# EAGLE schematic tyraka3.0 (EAGLE 9.6.2)
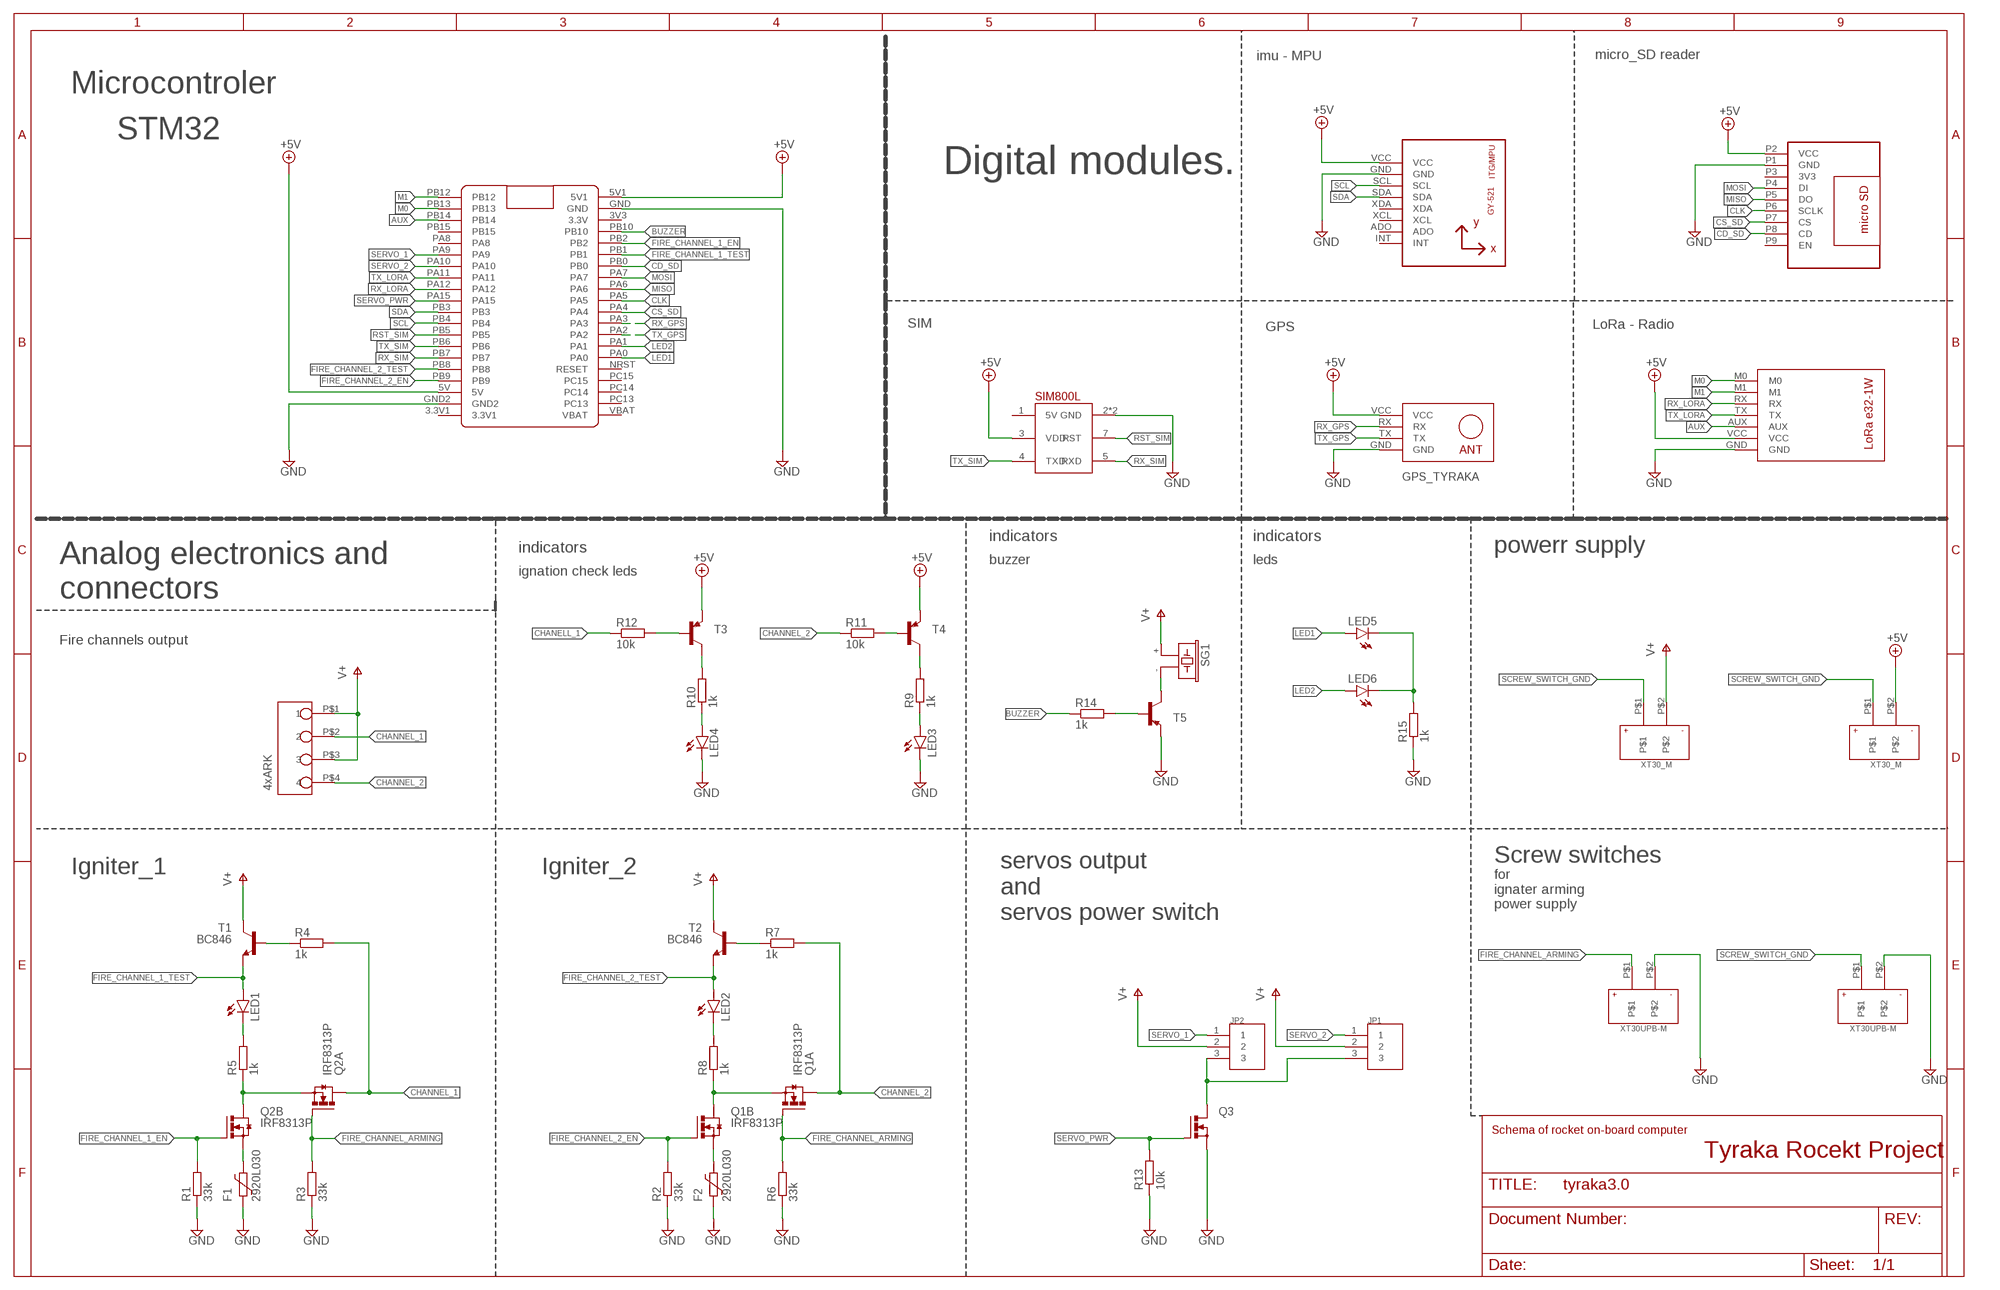
[diagram p0: schematic, sheet 1]

## Parts
F1  2920L030  [2920L]
F2  2920L030  [2920L]
JP1  3PIN  [B3B-PH-K-S]
JP2  3PIN  [B3B-PH-K-S]
LED1  LEDCHIP-LED0805  [CHIP-LED0805]
LED2  LEDCHIP-LED0805  [CHIP-LED0805]
LED3  LEDCHIP-LED0805  [CHIP-LED0805]
LED4  LEDCHIP-LED0805  [CHIP-LED0805]
LED5  LEDCHIP-LED0805  [CHIP-LED0805]
LED6  LEDCHIP-LED0805  [CHIP-LED0805]
Q1  IRF8313P  [SO-08]
Q2  IRF8313P  [SO-08]
Q3  N-MOSFET-SO8S  [SO-08]
R1  33k  R-EU_R0805  [R0805]
R2  33k  R-EU_R0805  [R0805]
R3  33k  R-EU_R0805  [R0805]
R4  1k  R-EU_R0805  [R0805]
R5  1k  R-EU_R0805  [R0805]
R6  33k  R-EU_R0805  [R0805]
R7  1k  R-EU_R0805  [R0805]
R8  1k  R-EU_R0805  [R0805]
R9  1k  R-EU_R0805  [R0805]
R10  1k  R-EU_R0805  [R0805]
R11  10k  R-EU_R0805  [R0805]
R12  10k  R-EU_R0805  [R0805]
R13  10k  R-EU_R0805  [R0805]
R14  1k  R-EU_R0805  [R0805]
R15  1k  R-EU_R0805  [R0805]
SD1  MICRO_SD  [MICRO_SD]
SG1  F/CM12P  [F/CM12P]
T1  BC846  [SOT23]
T2  BC846  [SOT23]
T3  BC856A-PNP-SOT23-BEC  [SOT23-BEC]
T4  BC856A-PNP-SOT23-BEC  [SOT23-BEC]
T5  BC856A-PNP-SOT23-BEC  [SOT23-BEC]
U2  GY-521MPU6050  [GY-521]
U$1  SIM800L  [SIP]
U$2  LORA_E32  [LORA_E32]
U$3  BLUE_PILL  [BLUE_PILL]
U$4  GPS_TYRAKA  [GPS-RECEIVER-NEO6M]
U$5  XT30_MALE_90  [XT60_MALE_90]
U$6  XT30_MALE_90  [XT60_MALE_90]
U$7  4X_ARK_8.5MM  [4XZLACZESRUBOWE]
U$8  XT30UPB-M  [XT30UPB-M]
U$9  XT30UPB-M  [XT30UPB-M]

## Nets
+5V: SD1.P2(VCC) T3.E T4.E U2.VCC U$1.3(VDD) U$2.VCC U$3.5V U$3.5V1 U$4.VCC U$6.P$2
AUX: U$2.AUX U$3.PB14
BUZZER: R14.1 U$3.PB10
CD_SD: SD1.P8(CD) U$3.PB0
CHANELL_1: R12.1
CHANNEL_1: Q2.5(A:D) Q2.6(A:D) R4.2 U$7.P$2
CHANNEL_2: Q1.5(A:D) Q1.6(A:D) R7.2 R11.1 U$7.P$4
CLK: SD1.P6(SCLK) U$3.PA5
CS_SD: SD1.P7(CS) U$3.PA4
FIRE_CHANNEL_1_EN: Q2.2(B:G) R1.2 U$3.PB2
FIRE_CHANNEL_1_TEST: LED1.A T1.2(E) U$3.PB1
FIRE_CHANNEL_2_EN: Q1.2(B:G) R2.2 U$3.PB9
FIRE_CHANNEL_2_TEST: LED2.A T2.2(E) U$3.PB8
FIRE_CHANNEL_ARMING: Q1.4(A:G) Q2.4(A:G) R3.2 R6.2 U$8.P$1
GND: F1.2 F2.2 LED3.C LED4.C Q3.1(S) Q3.2(S) Q3.3(S) R1.1 R2.1 R3.1 R6.1 R13.1 R15.1 SD1.P1(GND) T5.E U2.GND U$1.2(GND) U$1.6(GND) U$2.GND U$3.GND U$3.GND2 U$4.GND U$8.P$2 U$9.P$2
LED1: LED5.A U$3.PA0
LED2: LED6.A U$3.PA1
M0: U$2.M0 U$3.PB13
M1: U$2.M1 U$3.PB12
MISO: SD1.P5(DO) U$3.PA6
MOSI: SD1.P4(DI) U$3.PA7
N$1: F1.1 Q2.1(B:S)
N$2: F2.1 Q1.1(B:S)
N$3: Q2.3(A:S) Q2.7(B:D) Q2.8(B:D) R5.1
N$4: Q1.3(A:S) Q1.7(B:D) Q1.8(B:D) R8.1
N$5: LED1.C R5.2
N$6: SG1.- T5.C
N$7: LED2.C R8.2
N$8: R14.2 T5.B
N$9: R4.1 T1.1(B)
N$10: R7.1 T2.1(B)
N$11: R12.2 T3.B
N$12: R10.2 T3.C
N$13: LED4.A R10.1
N$14: LED5.C LED6.C R15.2
N$16: R9.2 T4.C
N$17: LED3.A R9.1
N$18: R11.2 T4.B
N$19: JP1.3 JP2.3 Q3.5(D) Q3.6(D) Q3.7(D) Q3.8(D)
RST_SIM: U$1.7(RST) U$3.PB5
RX_GPS: U$3.PA3 U$4.RX
RX_LORA: U$2.RX U$3.PA12
RX_SIM: U$1.5(RXD) U$3.PB7
SCL: U2.SCL U$3.PB4
SCREW_SWITCH_GND: U$5.P$1 U$6.P$1 U$9.P$1
SDA: U2.SDA U$3.PB3
SERVO_1: JP2.1 U$3.PA9
SERVO_2: JP1.1 U$3.PA10
SERVO_PWR: Q3.4(G) R13.2 U$3.PA15
TX_GPS: U$3.PA2 U$4.TX
TX_LORA: U$2.TX U$3.PA11
TX_SIM: U$1.4(TXD) U$3.PB6
V+: JP1.2 JP2.2 SG1.+ T1.3(C) T2.3(C) U$5.P$2 U$7.P$1 U$7.P$3
Unconnected: SD1.P3(3V3) SD1.P9(EN) U2.ADO U2.INT U2.XCL U2.XDA U$1.1(5V) U$3.3.3V1 U$3.3V3(3.3V) U$3.NRST(RESET) U$3.PA8 U$3.PB15 U$3.PC13 U$3.PC14 U$3.PC15 U$3.VBAT

## Notes on the sheet
- imu - MPU | micro_SD reader
- Microcontroler
- STM32
- Digital modules.
- SIM | GPS | LoRa - Radio
- indicators | indicators
- indicators | powerr supply
- buzzer | leds
- ignation check leds
- Analog electronics and
  connectors
- Fire channels output
- Screw switches
- Igniter_1 | Igniter_2
- for
  ignater arming
  power supply
- servos output
  and
  servos power switch
- Schema of rocket on-board computer
- Tyraka Rocekt Project

## Library data of the parts
F1 F2 = polyfuse-smd_10 (1):?: Polyfuse Resettable PTC Source: http://www.littelfuse.com/products/resettable-ptcs.aspx; MF: Littelfuse; MPN: 2920L030; OC_FARNELL: 1822222; OC_NEWARK: 18M4789
JP1 JP2 = jst_eph:3PIN
LED1-LED6 = led:LED: LED OSRAM: - CHIPLED LG R971, LG N971, LY N971, LG Q971, LY Q971, LO R971, LY R971 LH N974, LH R974 LS Q976, LO Q976, LY Q976 LO Q996 - Hyper CHIPLED LW Q18S LB Q993, LB Q99A, LB R99A - SideLED LS A670, LO A670, LY A670, LG A670, LP A670 LB A673, LV A673, LT A673, LW A673 LH A674 LY A675 LS A676, LA A676, LO A676, LY A676, LW A676 LS A679, LY A679, LG A679 - Hyper Micro SIDELED® LS Y876, LA Y876, LO Y876, LY Y876 LT Y87S - SmartLED LW L88C, LW L88S LB L89C, LB L89S, LG L890 LS L89K, LO L89K, LY L89K LS L896, LA L896, LO L896, LY L896 - TOPLED LS T670, LO T670, LY T670, LG T670, LP T670 LSG T670, LSP T670, LSY T670, LOP T670, LYG T670 LG T671, LOG T671, LSG T671 LB T673, LV T673, LT T673, LW T673 LH T674 LS T676, LA T676, LO T676, LY T676, LB T676, LH T676, LSB T676, LW T676 LB T67C, LV T67C, LT T67C, LS T67K, LO T67K, LY T67K, LW E67C LS E67B, LA E67B, LO E67B, LY E67B, LB E67C, LV E67C, LT E67C LW T67C LS T679, LY T679, LG T679 LS T770, LO T770, LY T770, LG T770, LP T770 LB T773, LV T773, LT T773, LW T773 LH T774 LS E675, LA E675, LY E675, LS T675 LS T776, LA T776, LO T776, LY T776, LB T776 LHGB T686 LT T68C, LB T68C - Hyper Mini TOPLED® LB M676 - Mini TOPLED Santana® LG M470 LS M47K, LO M47K, LY M47K Source: http://www.osram.convergy.de LUXEON: - LUMILED® LXK2-PW12-R00, LXK2-PW12-S00, LXK2-PW14-U00, LXK2-PW14-V00 LXK2-PM12-R00, LXK2-PM12-S00, LXK2-PM14-U00 LXK2-PE12-Q00, LXK2-PE12-R00, LXK2-PE12-S00, LXK2-PE14-T00, LXK2-PE14-U00 LXK2-PB12-K00, LXK2-PB12-L00, LXK2-PB12-M00, LXK2-PB14-N00, LXK2-PB14-P00, LXK2-PB14-Q00 LXK2-PR12-L00, LXK2-PR12-M00, LXK2-PR14-Q00, LXK2-PR14-R00 LXK2-PD12-Q00, LXK2-PD12-R00, LXK2-PD12-S00 LXK2-PH12-R00, LXK2-PH12-S00 LXK2-PL12-P00, LXK2-PL12-Q00, LXK2-PL12-R00 Source: www.luxeon.com KINGBRIGHT: KA-3528ASYC Source: www.kingbright.com
Q1 Q2 = transistor-power:IRF8313P: HEXFET(R) Power MOSFET Source: Data sheet <http://www.irf.com/product-info/datasheets/data/irf8313pbf.pdf>
Q3 = transistor-power:N-MOSFET-SO8: N-Channel MOSFET Example: FDS7760A; N-Channel Logic Level PowerTrench® MOSFET FDS2572; N-Channel UltraFET® Trench MOSFET Source: www.fairchildsemi.com
R1-R15 = rcl:R-EU_: RESISTOR, European symbol; SPICEPREFIX: R
SD1 = 111_microsd:MICRO_SD
SG1 = buzzer:F/CM12P: BUZZER Source: Buerklin; OC_FARNELL: unknown; OC_NEWARK: unknown
T1 T2 = transistor-neu-to92:BC846: NPN TRANSISTOR
T3-T5 = transistor:*-PNP-: PNP Transistror
U2 = 111_gy-521:GY-521
U$1 = SIM800L:SIM800L: SIM800L Blue EVB Board with Level Translation and diode dropper.
U$2 = 111_LoRa_e32:LORA_E32
U$3 = BluePill:BLUE_PILL
U$4 = 111_gps_tyraka:GPS_TYRAKA
U$5 U$6 = XT60PW-M:XT30_MALE_90
U$7 = 111_ark_8.5mm:4X_ARK_8.5MM
U$8 U$9 = XT60PW-M:XT30UPB-M